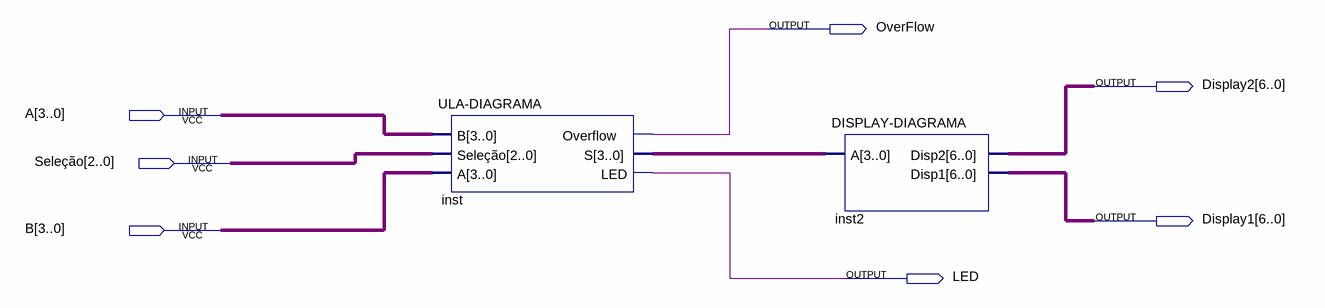
[diagram p0: schematic sheet]
// Quartus schematic ULA-DISPLAY-DIAGRAMA.bdf as structural Verilog: 2 symbols, 7 pins
module \ULA-DISPLAY-DIAGRAMA  (
  input  [3:0] A,
  input  [2:0] \Seleção ,
  input  [3:0] B,
  output OverFlow,
  output [6:0] Display2,
  output [6:0] Display1,
  output LED
);

  wire [3:0] inst_s;

  \ULA-DIAGRAMA  inst (.B(A), .\Seleção (\Seleção ), .A(B), .Overflow(OverFlow), .S(inst_s), .LED(LED));
  \DISPLAY-DIAGRAMA  inst2 (.A(inst_s), .Disp2(Display2), .Disp1(Display1));
endmodule
